# EAGLE design board (EAGLE 9.6.2)
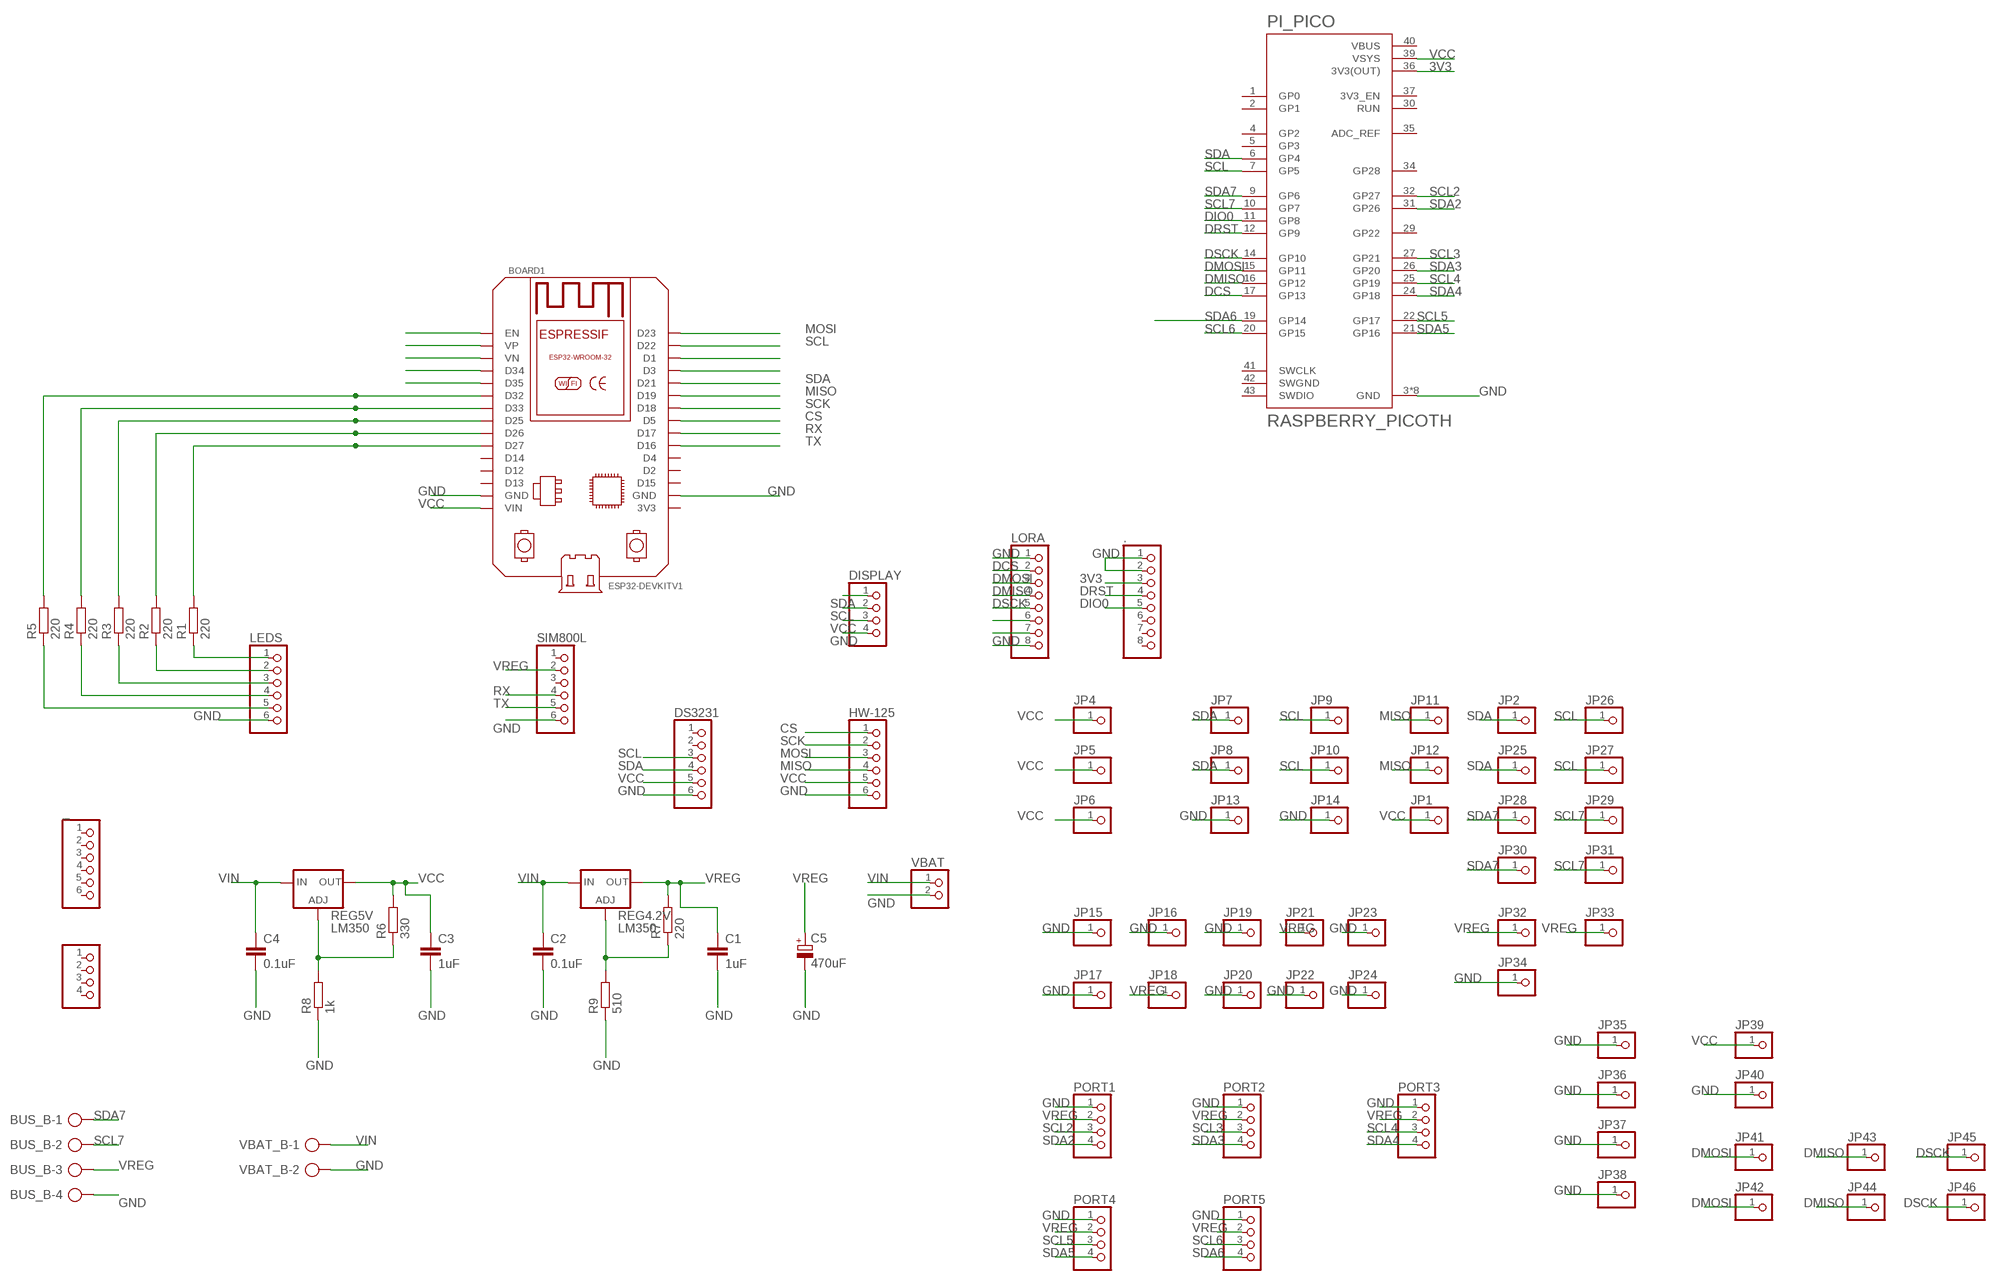
[diagram p0: schematic, sheet 1]

## Parts
.  PINHD-1X8  [1X08]
_  PINHD-1X6  [1X06]
BOARD1  ESP32DEVKITV1  [ESP32-DEVKITV1]
BUS_B  AK500/4-H  [AK500/4-H]
C1  1uF  C2.5/2  [C2.5-2]
C2  0.1uF  C2.5/2  [C2.5-2]
C3  1uF  C2.5/2  [C2.5-2]
C4  0.1uF  C2.5/2  [C2.5-2]
C5  470uF  CPOL-EUE3.5-8  [E3,5-8]
DISPLAY  PINHD-1X4  [1X04]
DS3231  PINHD-1X6  [1X06]
HW-125  PINHD-1X6  [1X06]
JP1  PINHD-1X1  [1X01]
JP2  PINHD-1X1  [1X01]
JP3  PINHD-1X4  [1X04]
JP4  PINHD-1X1  [1X01]
JP5  PINHD-1X1  [1X01]
JP6  PINHD-1X1  [1X01]
JP7  PINHD-1X1  [1X01]
JP8  PINHD-1X1  [1X01]
JP9  PINHD-1X1  [1X01]
JP10  PINHD-1X1  [1X01]
JP11  PINHD-1X1  [1X01]
JP12  PINHD-1X1  [1X01]
JP13  PINHD-1X1  [1X01]
JP14  PINHD-1X1  [1X01]
JP15  PINHD-1X1  [1X01]
JP16  PINHD-1X1  [1X01]
JP17  PINHD-1X1  [1X01]
JP18  PINHD-1X1  [1X01]
JP19  PINHD-1X1  [1X01]
JP20  PINHD-1X1  [1X01]
JP21  PINHD-1X1  [1X01]
JP22  PINHD-1X1  [1X01]
JP23  PINHD-1X1  [1X01]
JP24  PINHD-1X1  [1X01]
JP25  PINHD-1X1  [1X01]
JP26  PINHD-1X1  [1X01]
JP27  PINHD-1X1  [1X01]
JP28  PINHD-1X1  [1X01]
JP29  PINHD-1X1  [1X01]
JP30  PINHD-1X1  [1X01]
JP31  PINHD-1X1  [1X01]
JP32  PINHD-1X1  [1X01]
JP33  PINHD-1X1  [1X01]
JP34  PINHD-1X1  [1X01]
JP35  PINHD-1X1  [1X01]
JP36  PINHD-1X1  [1X01]
JP37  PINHD-1X1  [1X01]
JP38  PINHD-1X1  [1X01]
JP39  PINHD-1X1  [1X01]
JP40  PINHD-1X1  [1X01]
JP41  PINHD-1X1  [1X01]
JP42  PINHD-1X1  [1X01]
JP43  PINHD-1X1  [1X01]
JP44  PINHD-1X1  [1X01]
JP45  PINHD-1X1  [1X01]
JP46  PINHD-1X1  [1X01]
LEDS  PINHD-1X6  [1X06]
LORA  PINHD-1X8  [1X08]
PI_PICO  RASPBERRY_PICOTH  [PICO-PKG-TH]
PORT1  PINHD-1X4  [1X04]
PORT2  PINHD-1X4  [1X04]
PORT3  PINHD-1X4  [1X04]
PORT4  PINHD-1X4  [1X04]
PORT5  PINHD-1X4  [1X04]
R1  220  R-EU_R1206  [R1206]
R2  220  R-EU_R1206  [R1206]
R3  220  R-EU_R1206  [R1206]
R4  220  R-EU_R1206  [R1206]
R5  220  R-EU_R1206  [R1206]
R6  330  R-EU_0204/7  [0204/7]
R7  220  R-EU_0204/7  [0204/7]
R8  1k  R-EU_0204/7  [0204/7]
R9  510  R-EU_0204/7  [0204/7]
REG4.2V  LM350  LM317TS  [317TS]
REG5V  LM350  LM317TS  [317TS]
SIM800L  PINHD-1X6  [1X06]
VBAT  PINHD-1X2  [1X02]
VBAT_B  AK500/2-H  [AK500/2-H]

## Nets
3V3: ..3 PI_PICO.36(3V3(OUT))
CS: BOARD1.D5 HW-125.1
DCS: LORA.2 PI_PICO.17(GP13)
DIO0: ..5 PI_PICO.11(GP8)
DMISO: JP43.1 JP44.1 LORA.4 PI_PICO.16(GP12)
DMOSI: JP41.1 JP42.1 LORA.3 PI_PICO.15(GP11)
DRST: ..4 PI_PICO.12(GP9)
DSCK: JP45.1 JP46.1 LORA.5 PI_PICO.14(GP10)
GND: ..1 ..2 BOARD1.GND BOARD1.GND@1(GND) BUS_B.4 C1.2 C2.2 C3.2 C4.2 C5.- DISPLAY.4 DS3231.6 HW-125.6 JP13.1 JP14.1 JP15.1 JP16.1 JP17.1 JP19.1 JP20.1 JP22.1 JP23.1 JP24.1 JP34.1 JP35.1 JP36.1 JP37.1 JP38.1 JP40.1 LEDS.6 LORA.1 LORA.8 PI_PICO.3(GND) PI_PICO.8(GND) PI_PICO.13(GND) PI_PICO.18(GND) PI_PICO.23(GND) PI_PICO.28(GND) PI_PICO.33(GND) PI_PICO.38(GND) PORT1.1 PORT2.1 PORT3.1 PORT4.1 PORT5.1 R8.1 R9.1 SIM800L.6 VBAT.2 VBAT_B.2
MISO: BOARD1.D19 HW-125.4 JP11.1 JP12.1
MOSI: BOARD1.D23 HW-125.3
N$1: BOARD1.EN
N$2: BOARD1.VP
N$3: BOARD1.VN
N$4: BOARD1.D34
N$5: BOARD1.D35
N$6: BOARD1.D32 R5.2
N$7: BOARD1.D33 R4.2
N$8: BOARD1.D25 R3.2
N$9: BOARD1.D26 R2.2
N$10: BOARD1.D27 R1.2
N$11: LEDS.1 R1.1
N$13: LEDS.2 R2.1
N$14: LEDS.3 R3.1
N$15: LEDS.4 R4.1
N$16: LEDS.5 R5.1
N$18: BOARD1.D1
N$19: BOARD1.D3
N$21: R6.1 R8.2 REG5V.1(ADJ)
N$22: R7.1 R9.2 REG4.2V.1(ADJ)
N$27: LORA.6
N$29: LORA.7
RX: BOARD1.D17 SIM800L.4
SCK: BOARD1.D18 HW-125.2
SCL: BOARD1.D22 DISPLAY.2 DS3231.3 JP9.1 JP10.1 JP26.1 JP27.1 PI_PICO.7(GP5)
SCL2: PI_PICO.32(GP27) PORT1.3
SCL3: PI_PICO.27(GP21) PORT2.3
SCL4: PI_PICO.25(GP19) PORT3.3
SCL5: PI_PICO.22(GP17) PORT4.3
SCL6: PI_PICO.20(GP15) PORT5.3
SCL7: BUS_B.2 JP29.1 JP31.1 PI_PICO.10(GP7)
SDA: BOARD1.D21 DISPLAY.1 DS3231.4 JP2.1 JP7.1 JP8.1 JP25.1 PI_PICO.6(GP4)
SDA2: PI_PICO.31(GP26) PORT1.4
SDA3: PI_PICO.26(GP20) PORT2.4
SDA4: PI_PICO.24(GP18) PORT3.4
SDA5: PI_PICO.21(GP16) PORT4.4
SDA6: PI_PICO.19(GP14) PORT5.4
SDA7: BUS_B.1 JP28.1 JP30.1 PI_PICO.9(GP6)
TX: BOARD1.D16 SIM800L.5
VCC: BOARD1.VIN C3.1 DISPLAY.3 DS3231.5 HW-125.5 JP1.1 JP4.1 JP5.1 JP6.1 JP39.1 PI_PICO.39(VSYS) R6.2 REG5V.2(OUT)
VIN: C2.1 C4.1 REG4.2V.3(IN) REG5V.3(IN) VBAT.1 VBAT_B.1
VREG: BUS_B.3 C1.1 C5.+ JP18.1 JP21.1 JP32.1 JP33.1 PORT1.2 PORT2.2 PORT3.2 PORT4.2 PORT5.2 R7.2 REG4.2V.2(OUT) SIM800L.2
Unconnected: ..6 ..7 ..8 _.1 _.2 _.3 _.4 _.5 _.6 BOARD1.3V3 BOARD1.D2 BOARD1.D4 BOARD1.D12 BOARD1.D13 BOARD1.D14 BOARD1.D15 DS3231.1 DS3231.2 JP3.1 JP3.2 JP3.3 JP3.4 PI_PICO.1(GP0) PI_PICO.2(GP1) PI_PICO.4(GP2) PI_PICO.5(GP3) PI_PICO.29(GP22) PI_PICO.30(RUN) PI_PICO.34(GP28) PI_PICO.35(ADC_REF) PI_PICO.37(3V3_EN) PI_PICO.41(SWCLK) PI_PICO.43(SWDIO) SIM800L.1 SIM800L.3

## Power pins joined to a net without a drawn wire
SWGND: PI_PICO.42(SWGND)
VBUS: PI_PICO.40(VBUS)

## Library data of the parts
. LORA = pinhead:PINHD-1X8: PIN HEADER
_ DS3231 HW-125 LEDS SIM800L = pinhead:PINHD-1X6: PIN HEADER
BOARD1 = ESP32-DEVKITV1:ESP32DEVKITV1: https://github.com/shridattdudhat
BUS_B = con-ptr500:AK500/4-H: CONNECTOR Aug. 2004 / PTR Meßtechnik: Die Bezeichnung der Serie AK505 wurde geändert. Es handelt sich hierbei um AK500 in horizontaler Ausführung.; OC_FARNELL: unknown; OC_NEWARK: unknown
C1-C4 = capacitor-wima:C: CAPACITOR naming: grid - package width
C5 = rcl:CPOL-EU: POLARIZED CAPACITOR, European symbol; SPICEPREFIX: C
DISPLAY JP3 PORT1-PORT5 = pinhead:PINHD-1X4: PIN HEADER
JP1 JP2 JP4-JP46 = pinhead:PINHD-1X1: PIN HEADER
PI_PICO = RpiPico:RASPBERRY_PICO: Raspberry Pi Pico
R1-R9 = rcl:R-EU_: RESISTOR, European symbol; SPICEPREFIX: R
REG4.2V REG5V = v-reg:LM317TS: VOLTAGE REGULATOR
VBAT = pinhead:PINHD-1X2: PIN HEADER
VBAT_B = con-ptr500:AK500/2-H: CONNECTOR Aug. 2004 / PTR Meßtechnik: Die Bezeichnung der Serie AK505 wurde geändert. Es handelt sich hierbei um AK500 in horizontaler Ausführung.; OC_FARNELL: unknown; OC_NEWARK: unknown

## Board
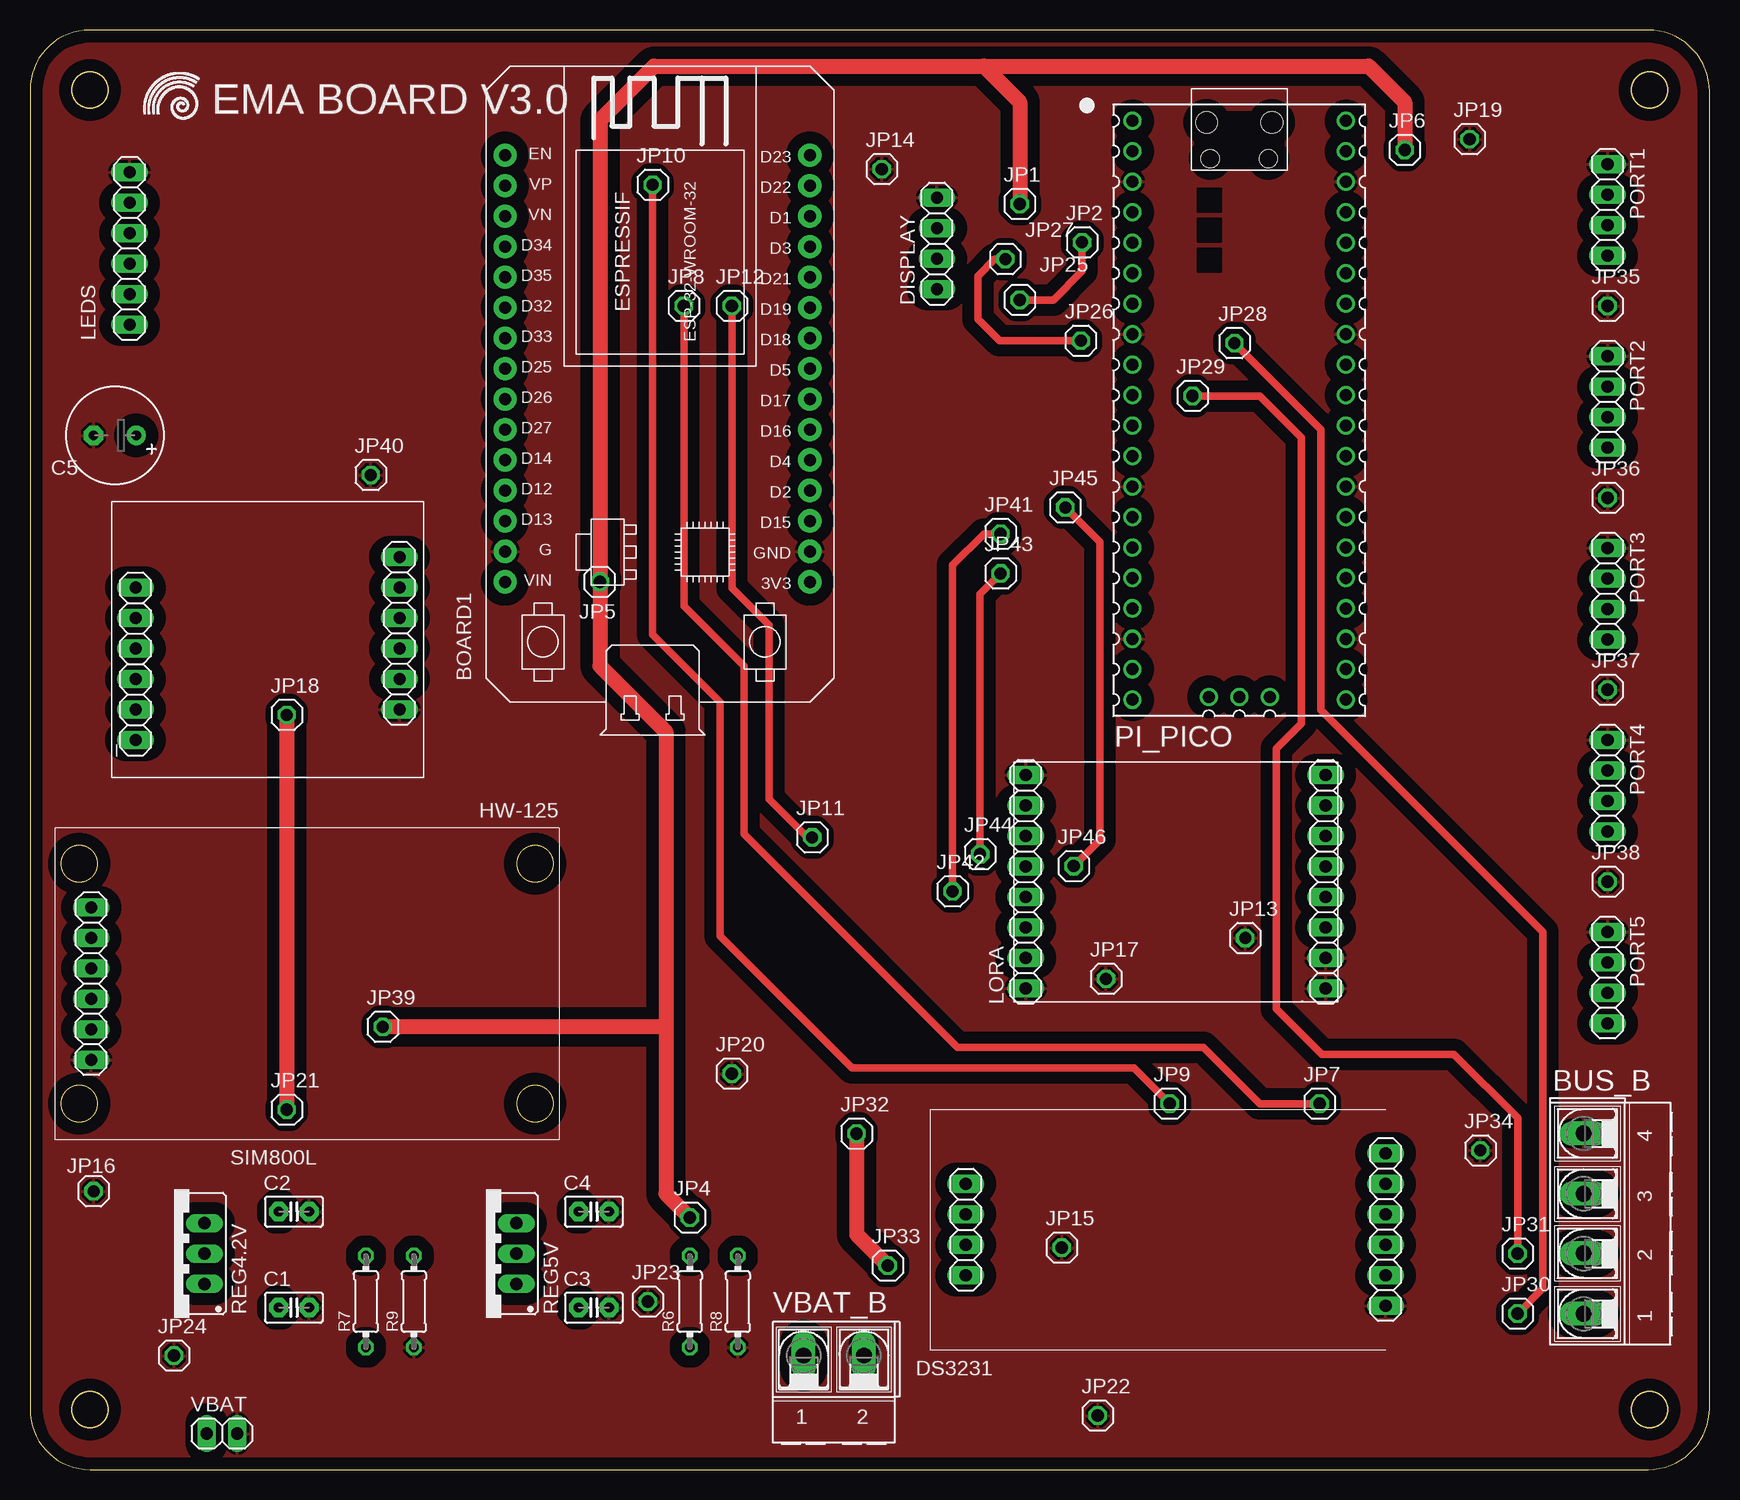
[diagram p1: board, top side]
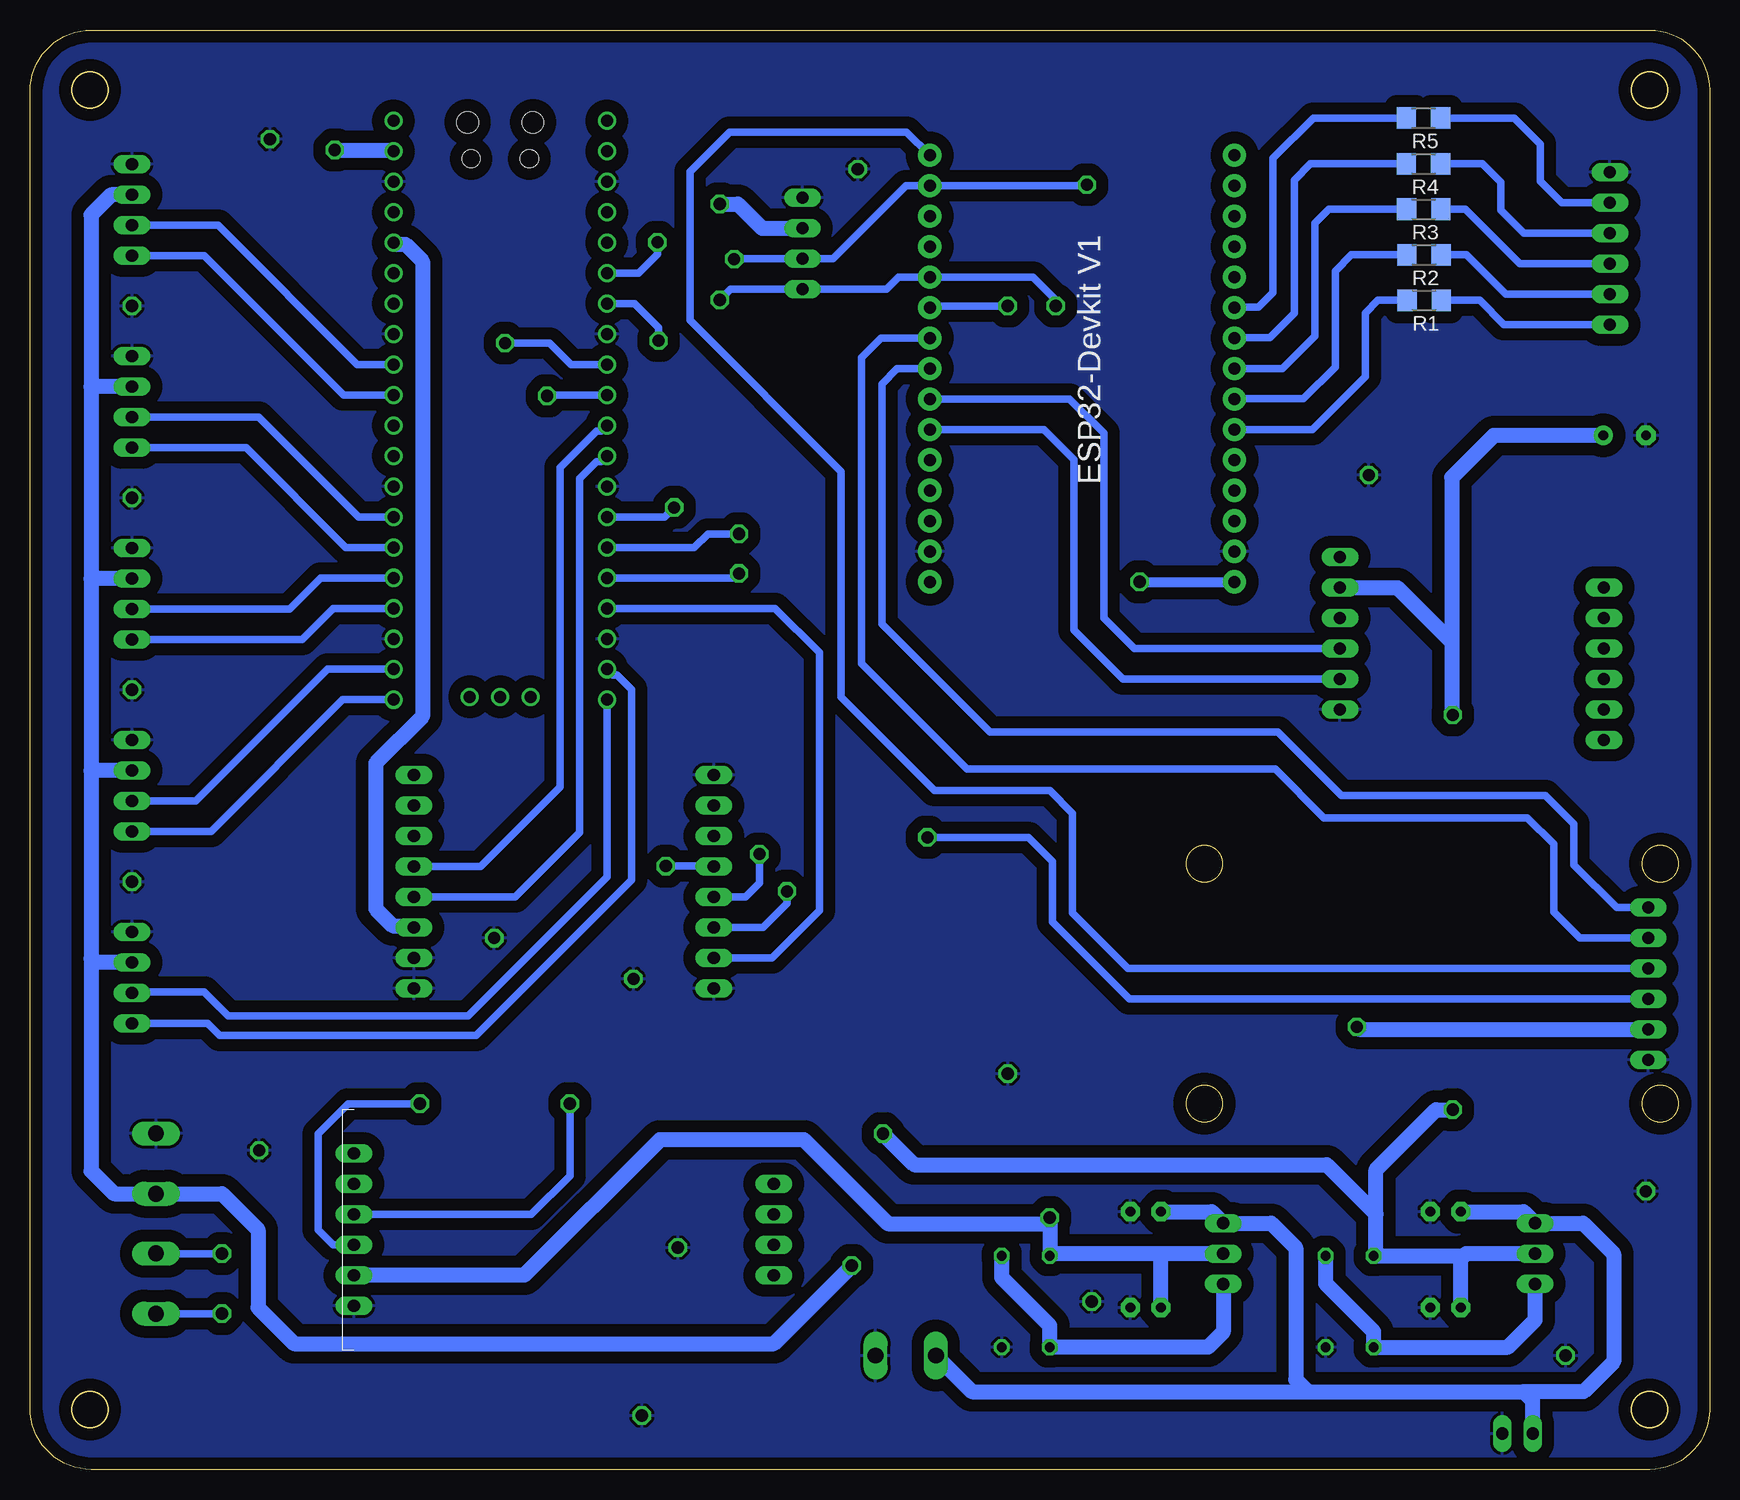
[diagram p2: board, bottom side, seen from below]

Size 140 x 120 mm. Coordinates in mm from the lower left corner, seen from the top.
Outline: 0,115 0,5 arc90 5,0 134.88,0 arc90 140,5.12 140,114.88 arc90 134.88,120 5,120 arc90 0,115
Outline: circle at 5,115 radius 1.5
Outline: circle at 135,115 radius 1.5
Outline: circle at 5,5 radius 1.5
Outline: circle at 135,5 radius 1.5
Outline: circle at 4.1,30.5 radius 1.5
Outline: circle at 4.1,50.5 radius 1.5
Outline: circle at 42.1,50.5 radius 1.5
Outline: circle at 42.1,30.5 radius 1.5
Copper layers (1*16): Top 0.035mm / dielectric 1.5mm / Bottom 0.035mm
Design rules "default *": minimum track width 6mil, minimum drill 0.35mm, track to track 40mil, track to pad 40mil, pad to pad 20mil, via to via 20mil, smd to smd 6mil, copper to edge 40mil, drill to drill 6mil, minimum pad ring 10mil, minimum via ring 8mil, stop-mask expansion 4mil, vias tented up to drill 0mil, thermal gap 10mil

### Footprints (pad centres in the part's own frame; a part is rotated, then mirrored left to right if it is on the bottom)
1X08 = drill 1.016 long: 1 -8.89,0; 2 -6.35,0; 3 -3.81,0; 4 -1.27,0; 5 1.27,0; 6 3.81,0; 7 6.35,0; 8 8.89,0
1X06 = drill 1.016 long: 1 -6.35,0; 2 -3.81,0; 3 -1.27,0; 4 1.27,0; 5 3.81,0; 6 6.35,0
ESP32-DEVKITV1 = drill 1 pad 1.93: 3V3 0,0; D1 30.48,0; D2 7.62,0; D3 27.94,0; D4 10.16,0; D5 17.78,0; D12 7.62,25.4; D13 5.08,25.4; D14 10.16,25.4; D15 5.08,0; D16 12.7,0; D17 15.24,0; D18 20.32,0; D19 22.86,0; D21 25.4,0; D22 33.02,0; D23 35.56,0; D25 17.78,25.4; D26 15.24,25.4; D27 12.7,25.4; D32 22.86,25.4; D33 20.32,25.4; D34 27.94,25.4; D35 25.4,25.4; EN 35.56,25.4; GND 2.54,25.4; GND@1 2.54,0; VIN 0,25.4; VN 30.48,25.4; VP 33.02,25.4
AK500/4-H = drill 1.321 long: 1 -7.518,0; 2 -2.489,0; 3 2.489,0; 4 7.518,0
C2.5-2 = drill 0.813 pad 1.6 octagon: 1 -1.27,0; 2 1.27,0
E3,5-8 = drill 0.813 pad 1.6: + -1.778,0 | drill 0.813 pad 1.6 octagon: - 1.778,0
1X04 = drill 1.016 long: 1 -3.81,0; 2 -1.27,0; 3 1.27,0; 4 3.81,0
1X01 = drill 1.016 octagon: 1 0,0
PICO-PKG-TH = drill 1: 1 -8.89,24.13; 2 -8.89,21.59; 3 -8.89,19.05; 4 -8.89,16.51; 5 -8.89,13.97; 6 -8.89,11.43; 7 -8.89,8.89; 8 -8.89,6.35; 9 -8.89,3.81; 10 -8.89,1.27; 11 -8.89,-1.27; 12 -8.89,-3.81; 13 -8.89,-6.35; 14 -8.89,-8.89; 15 -8.89,-11.43; 16 -8.89,-13.97; 17 -8.89,-16.51; 18 -8.89,-19.05; 19 -8.89,-21.59; 20 -8.89,-24.13; 21 8.89,-24.13; 22 8.89,-21.59; 23 8.89,-19.05; 24 8.89,-16.51; 25 8.89,-13.97; 26 8.89,-11.43; 27 8.89,-8.89; 28 8.89,-6.35; 29 8.89,-3.81; 30 8.89,-1.27; 31 8.89,1.27; 32 8.89,3.81; 33 8.89,6.35; 34 8.89,8.89; 35 8.89,11.43; 36 8.89,13.97; 37 8.89,16.51; 38 8.89,19.05; 39 8.89,21.59; 40 8.89,24.13; 41 -2.54,-23.9; 42 0,-23.9; 43 2.54,-23.9 | hole 1.8: -2.725,24; 2.725,24 | hole 1.5: -2.425,20.97; 2.425,20.97
R1206 = smd 1.6 x 1.803: 1 -1.422,0; 2 1.422,0
0204/7 = drill 0.813 octagon: 1 -3.81,0; 2 3.81,0
317TS = drill 1.016 long: 1 -2.54,-2.54; 2 0,-2.54; 3 2.54,-2.54
1X02 = drill 1.016 long: 1 -1.27,0; 2 1.27,0
AK500/2-H = drill 1.321 long: 1 -2.515,0; 2 2.515,0

### Placement (x,y rotation side)
.  108,49 90 top
_  8.8,67.16 90 top
BOARD1  65,74 90 top
BUS_B  129.5,20.5 90 top
C1  22,13.5 0 top
C2  22,21.5 0 top
C3  47,13.5 0 top
C4  47,21.5 0 top
C5  7.08,86.2 180 top
DISPLAY  75.6,102.2 90 top
DS3231  113,20 270 top
HW-125  5.1,40.5 270 top
JP1  82.5,105.5 0 top
JP2  87.7,102.3 0 top
JP3  78,20 90 top
JP4  55,21 0 top
JP5  47.5,74 180 top
JP6  114.6,110 0 top
JP7  107.5,30.5 0 top
JP8  54.5,97 0 top
JP9  95,30.5 0 top
JP10  51.9,107.1 0 top
JP11  65.2,52.7 0 top
JP12  58.5,97 0 top
JP13  101.3,44.3 0 top
JP14  71,108.4 0 top
JP15  86,18.5 0 top
JP16  5.3,23.2 0 top
JP17  89.7,40.9 0 top
JP18  21.4,62.9 0 top
JP19  120,110.9 0 top
JP20  58.5,33 0 top
JP21  21.4,30 0 top
JP22  89,4.5 0 top
JP23  51.5,14 0 top
JP24  12,9.5 0 top
JP25  82.5,97.5 0 top
JP26  87.6,94.1 0 top
JP27  81.3,100.9 0 top
JP28  100.4,93.9 0 top
JP29  96.9,89.5 0 top
JP30  124,13 0 top
JP31  124,18 0 top
JP32  68.9,28 0 top
JP33  71.5,17 0 top
JP34  120.9,26.6 0 top
JP35  131.5,97 0 top
JP36  131.5,81 0 top
JP37  131.5,65 0 top
JP38  131.5,49 0 top
JP39  29.4,36.9 0 top
JP40  28.4,82.9 0 top
JP41  80.9,78 0 top
JP42  76.9,48.2 0 top
JP43  80.9,74.7 0 top
JP44  79.2,51.3 0 top
JP45  86.3,80.2 0 top
JP46  87,50.3 0 top
LEDS  8.3,101.8 90 top
LORA  83,49 90 top
PI_PICO  100.8,88.3 0 top
PORT1  131.5,105 270 top
PORT2  131.5,89 270 top
PORT3  131.5,73 270 top
PORT4  131.5,57 270 top
PORT5  131.5,41 270 top
R1  23.78,97.46 180 bottom
R2  23.8,101.26 180 bottom
R3  23.82,105.06 180 bottom
R4  23.84,108.84 180 bottom
R5  23.84,112.66 180 bottom
R6  55,14 90 top
R7  28,14 90 top
R8  59,14 90 top
R9  32,14 90 top
REG4.2V  12,18 90 top
REG5V  38,18 90 top
SIM800L  30.8,69.7 270 top
VBAT  16,3 0 top
VBAT_B  67,9.5 0 top

### Tracks (layer width: path | path; a pad name or v marks a point on that pad's centre or on a via)
3V3
  Bottom 1.27: PI_PICO.36 109.56,102.14 108.69,102.14 107.28,100.73 107.28,62.78 111.17,58.89 111.17,46.73 109.76,45.32 108.13,45.32 ..3
CS
  Bottom 0.61: BOARD1.D5 67.72,91.78 69,90.5 69,70.5 60,61.5 36,61.5 30.7,56.2 13.7,56.2 11.3,53.8 11.3,50.4 7.75,46.85 HW-125.1
DCS
  Bottom 0.61: PI_PICO.17 77.89,71.79 74.2,68.1 74.2,46.6 78.15,42.65 LORA.2
DIO0
  Bottom 0.61: PI_PICO.11 92.38,86.56 92.77,86.56 95.8,83.53 95.8,56.9 102.43,50.27 ..5
DMISO
  Top 0.61: JP43.1 79.2,73 JP44.1
  Bottom 0.61: PI_PICO.16 81.27,74.33 JP43.1 | JP44.1 79.2,48.9 80.37,47.73 LORA.4
DMOSI
  Top 0.61: JP41.1 79.5,78 76.9,75.4 JP42.1
  Bottom 0.61: PI_PICO.15 84.63,76.87 83.5,78 JP41.1 | JP42.1 76.9,47.2 78.91,45.19 LORA.3
DRST
  Bottom 0.61: PI_PICO.12 92.38,84.03 92.77,84.03 94.17,82.62 94.17,56.23 94.2,56.2 94.2,53.1 99.57,47.73 ..4
DSCK
  Top 0.61: JP45.1 89.2,77.3 89.2,52.5 JP46.1
  Bottom 0.61: JP45.1 87.09,79.41 PI_PICO.14 | JP46.1 83.03,50.3 LORA.5
GND
  pour Top: 4.41,119 135.59,119 arc-90 139,115.59 139,4.41 arc-90 135.59,1 4.41,1 arc-90 1,4.41 1,115.59 arc-90
  pour Bottom: 4.41,119 135.59,119 arc-90 139,115.59 139,4.41 arc-90 135.59,1 4.41,1 arc-90 1,4.41 1,115.59 arc-90
MISO
  Top 0.61: JP12.1 58.5,73.5 61.6,70.4 61.6,55.9 64.8,52.7 JP11.1
  Bottom 0.61: BOARD1.D19 64.86,97 JP12.1 | JP11.1 56.77,52.7 54.77,50.7 54.77,45.63 48.37,39.23 HW-125.4
MOSI
  Bottom 0.61: BOARD1.D23 66.94,111.5 81.7,111.5 85,108.2 85,95.8 72.4,83.2 72.4,64.4 64.6,56.6 55,56.6 53.1,54.7 53.1,46.4 48.47,41.77 HW-125.3
N$6
  Bottom 0.508: 39.58,96.88 BOARD1.D32
  Bottom 0.61: R5.2 33.04,112.66 36.4,109.3 36.4,98.1 37.62,96.88 39.58,96.88
N$7
  Bottom 0.508: 39.58,94.34 BOARD1.D33
  Bottom 0.61: R4.2 33.26,108.84 34.6,107.5 34.6,96.4 36.66,94.34 39.58,94.34
N$8
  Bottom 0.61: R3.2 31.74,105.06 32.9,103.9 32.9,94.5 35.62,91.78 BOARD1.D25
N$9
  Bottom 0.508: 39.58,89.26 BOARD1.D26
  Bottom 0.61: R2.2 29.84,101.26 31.2,99.9 31.2,91.9 33.84,89.26 39.58,89.26
N$10
  Bottom 0.61: R1.2 27.64,97.46 28.7,96.4 28.7,91.1 33.1,86.7 BOARD1.D27
N$11
  Bottom 0.61: R1.1 19.16,97.46 17.15,95.45 LEDS.1
N$13
  Bottom 0.61: R2.1 20.26,101.26 16.99,97.99 LEDS.2
N$14
  Bottom 0.61: R3.1 20.36,105.06 15.83,100.53 LEDS.3
N$15
  Bottom 0.61: R4.1 18.94,108.84 17.4,107.3 17.4,105 15.47,103.07 LEDS.4
N$16
  Bottom 0.61: R5.1 16.26,112.66 14.1,110.5 14.1,107.4 12.31,105.61 LEDS.5
N$21
  Bottom 1.27: REG5V.1 40.54,11.46 41.81,10.19 R6.1 55,12 59,16 R8.2
N$22
  Bottom 1.27: REG4.2V.1 14.54,12.46 16.81,10.19 R7.1 28,11.5 32,15.5 R9.2
RX
  Bottom 0.61: SIM800L.4 47.93,68.43 50.5,71 50.5,86.4 53.34,89.24 BOARD1.D17
SCK
  Bottom 0.61: HW-125.2 10.81,44.31 13,46.5 13,52.16 15.17,54.33 32.13,54.33 36.2,58.4 61.9,58.4 70.7,67.2 70.7,92.7 69.08,94.32 BOARD1.D18
SCL
  Top 0.61: JP10.1 51.9,69.6 57.5,64 57.5,44.5 68.5,33.5 92,33.5 JP9.1 | JP27.1 80.4,100.9 79,99.5 79,95.9 80.8,94.1 JP26.1
  Bottom 0.61: DS3231.3 98.23,21.27 95,24.5 JP9.1 | JP10.1 51.98,107.02 BOARD1.D22 66.98,107.02 73.07,100.93 DISPLAY.2 81.27,100.93 JP27.1 | JP26.1 87.6,95.2 89.59,97.19 PI_PICO.7
SCL2
  Bottom 0.61: PI_PICO.32 112.71,92.11 124.33,103.73 PORT1.3
SCL3
  Bottom 0.61: PI_PICO.27 112.61,79.41 120.93,87.73 PORT2.3
SCL4
  Bottom 0.61: PI_PICO.25 115.77,74.33 118.37,71.73 PORT3.3
SCL5
  Bottom 0.61: PI_PICO.22 115.19,66.71 126.17,55.73 PORT4.3
SCL6
  Bottom 0.61: PI_PICO.20 91.91,49.39 103.5,37.8 123.5,37.8 125.5,39.8 131.43,39.8 PORT5.3
SCL7
  Top 0.61: JP29.1 102.5,89.5 105.99,86.01 105.99,62.19 103.9,60.1 103.9,38.4 107.7,34.6 118.7,34.6 124,29.3 JP31.1
  Bottom 0.61: PI_PICO.10 96.83,89.57 JP29.1 | JP31.1 BUS_B.2
SDA
  Top 0.61: JP7.1 102.5,30.5 97.8,35.2 77.3,35.2 59.5,53 59.5,67 54.5,72 JP8.1 | JP25.1 85.3,97.5 87.7,99.9 JP2.1
  Bottom 0.61: DS3231.4 114.73,18.73 116,20 116,28 113.5,30.5 JP7.1 | JP8.1 54.5,97.5 56.4,99.4 BOARD1.D21 67.6,99.4 68.61,98.39 DISPLAY.1 81.61,98.39 JP25.1 | JP2.1 87.7,101.3 89.27,99.73 PI_PICO.6
SDA2
  Bottom 0.61: PI_PICO.31 113.87,89.57 125.49,101.19 PORT1.4
SDA3
  Bottom 0.61: PI_PICO.26 113.67,76.87 121.99,85.19 PORT2.4
SDA4
  Bottom 0.61: PI_PICO.24 114.71,71.79 117.31,69.19 PORT3.4
SDA5
  Bottom 0.61: PI_PICO.21 113.93,64.17 124.91,53.19 PORT4.4
SDA6
  Bottom 0.61: PORT5.4 125.19,37.19 124.17,36.17 102.83,36.17 89.83,49.17 89.83,65.03 91.05,66.25 91.44,66.25 PI_PICO.19
SDA7
  Top 0.61: JP28.1 107.61,86.69 107.61,63.31 126.1,44.83 126.1,15.1 JP30.1
  Bottom 0.61: PI_PICO.9 94.91,92.11 96.7,93.9 JP28.1 | JP30.1 129.48,13 BUS_B.1
TX
  Bottom 0.61: SIM800L.5 48.89,65.89 53,70 53,84.2 55.5,86.7 BOARD1.D16
VCC
  Top 1.27: 79.5,117 52,117 47.5,112.5 JP5.1 47.5,67 53,61.5 53,36.9 | 53,36.9 53,23 JP4.1 | 79.5,117 82.5,114 JP1.1 | 53,36.9 JP39.1 | 79.5,117 111.6,117 114.6,114 JP6.1
  Bottom 0.813: JP5.1 BOARD1.VIN
  Bottom 1.27: REG5V.2 46,18 | C3.1 45.73,17.73 46,18 | 46,18 54.81,18 R6.2 JP4.1 55.5,20.5 68.5,20.5 75.5,27.5 87.5,27.5 98.81,16.19 DS3231.5 | JP1.1 81,105.5 78.97,103.47 DISPLAY.3 | JP39.1 29.19,36.69 HW-125.5 | JP6.1 109.8,110 PI_PICO.39
VIN
  Bottom 1.27: C4.1 41.5,21.5 REG5V.3 36.54,20.54 34.5,18.5 34.5,7.5 33.5,6.5 | C2.1 15.5,21.5 REG4.2V.3 10.54,20.54 8,18 8,9 10.5,6.5 15.5,6.5 | 33.5,6.5 15.5,6.5 | VBAT.1 14.73,5.73 15.5,6.5 | VBAT_B.1 61.48,6.5 33.5,6.5
VREG
  Top 1.27: JP32.1 68.9,19.6 JP33.1 | JP18.1 JP21.1
  Bottom 1.27: 27.8,21.3 27.8,18.01 R7.2 20.5,17.81 | C1.1 20.73,17.58 20.5,17.81 | REG4.2V.2 20.31,18 20.5,17.81 | JP33.1 78,10.5 118,10.5 121,13.5 121,20 123.99,22.99 BUS_B.3 133,22.99 134.9,24.89 134.9,42.57 | SIM800L.2 26.01,73.51 21.5,69 | PORT1.2 133.23,106.27 134.9,104.6 134.9,90.27 | PORT4.2 134.9,58.27 | C5.+ 18,86.2 21.5,82.7 21.5,69 | JP32.1 66.3,25.4 31.9,25.4 27.8,21.3 | PORT3.2 134.9,74.27 | PORT2.2 134.9,90.27 | PORT5.2 134.6,42.27 134.9,42.57 | 21.5,69 21.5,63 JP18.1 | 134.9,90.27 134.9,74.27 | 134.9,74.27 134.9,58.27 | 134.9,58.27 134.9,42.57 | 27.8,21.3 27.8,25 22.8,30 JP21.1

### Text on the board
tPlace: EMA BOARD V3.0